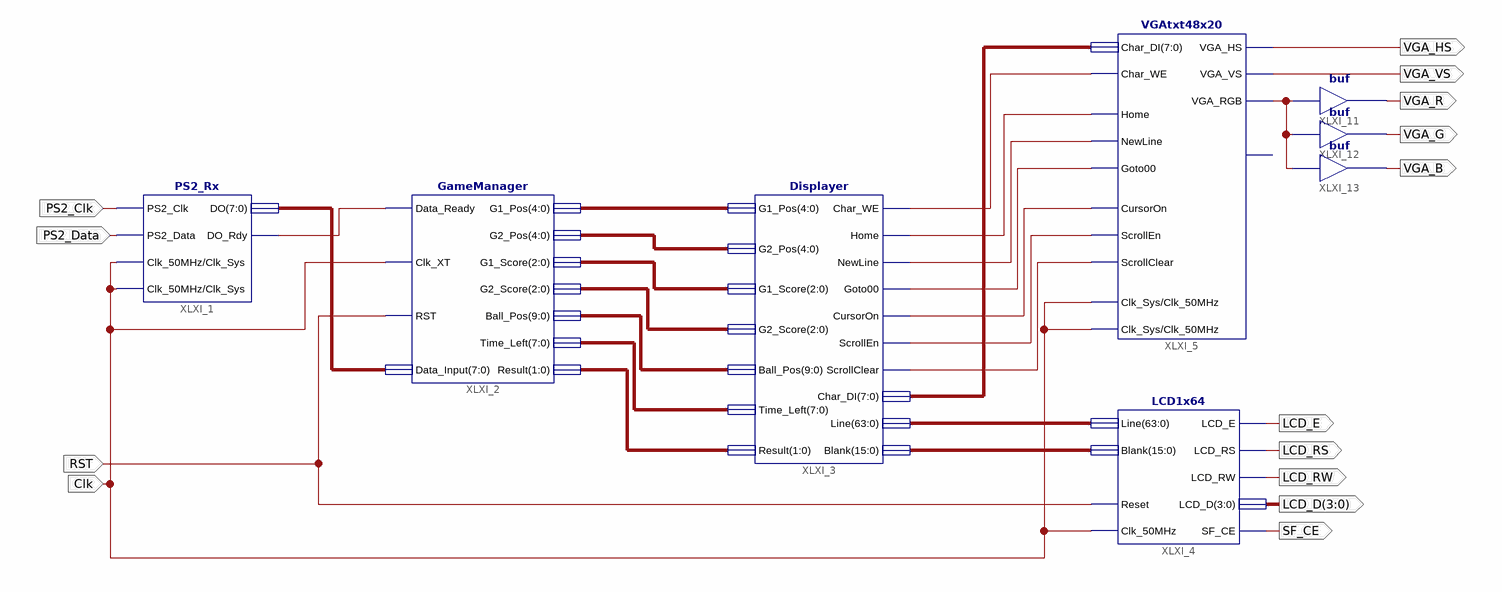
[diagram p0: schematic sheet 1]
// Xilinx ISE schematic Football.sch (spartan3e) as structural Verilog: 8 symbols, 14 ports
module Football (
  input  RST,
  input  Clk,
  input  PS2_Clk,
  input  PS2_Data,
  output VGA_HS,
  output VGA_VS,
  output VGA_R,
  output VGA_G,
  output VGA_B,
  output LCD_E,
  output LCD_RS,
  output LCD_RW,
  output [3:0] LCD_D,
  output SF_CE
);

  wire XLXN_2, XLXN_11, XLXN_12, XLXN_13, XLXN_14, XLXN_15, XLXN_16, XLXN_17, XLXN_54;
  wire [1:0] XLXN_9;
  wire [2:0] XLXN_5, XLXN_6;
  wire [4:0] XLXN_3, XLXN_4;
  wire [7:0] XLXN_1, XLXN_8, XLXN_10;
  wire [9:0] XLXN_7;
  wire [15:0] XLXN_19;
  wire [63:0] XLXN_18;

  PS2_Rx XLXI_1 (.PS2_Clk(PS2_Clk), .PS2_Data(PS2_Data), .Clk_50MHz(Clk), .Clk_Sys(Clk), .DO_Rdy(XLXN_2), .DO(XLXN_1));
  GameManager XLXI_2 (
    .Data_Ready(XLXN_2), .Clk_XT(Clk), .RST(RST), .Data_Input(XLXN_1), .G1_Pos(XLXN_3), .G2_Pos(XLXN_4),
    .G1_Score(XLXN_5), .G2_Score(XLXN_6), .Ball_Pos(XLXN_7), .Time_Left(XLXN_8), .Result(XLXN_9));
  Displayer XLXI_3 (
    .G1_Pos(XLXN_3), .G2_Pos(XLXN_4), .G1_Score(XLXN_5), .G2_Score(XLXN_6), .Ball_Pos(XLXN_7),
    .Time_Left(XLXN_8), .Result(XLXN_9), .Char_WE(XLXN_11), .Home(XLXN_12), .NewLine(XLXN_13),
    .Goto00(XLXN_14), .CursorOn(XLXN_15), .ScrollEn(XLXN_16), .ScrollClear(XLXN_17), .Char_DI(XLXN_10),
    .Line(XLXN_18), .Blank(XLXN_19));
  VGAtxt48x20 XLXI_5 (
    .Char_DI(XLXN_10), .Home(XLXN_12), .NewLine(XLXN_13), .Goto00(XLXN_14), .Clk_Sys(Clk), .Clk_50MHz(Clk),
    .CursorOn(XLXN_15), .ScrollEn(XLXN_16), .ScrollClear(XLXN_17), .VGA_HS(VGA_HS), .VGA_VS(VGA_VS),
    .VGA_RGB(XLXN_54), .Char_WE(XLXN_11));  // open: Busy
  LCD1x64 XLXI_4 (
    .Clk_50MHz(Clk), .Reset(RST), .Line(XLXN_18), .Blank(XLXN_19), .LCD_D(LCD_D), .LCD_E(LCD_E),
    .LCD_RW(LCD_RW), .LCD_RS(LCD_RS), .SF_CE(SF_CE));
  buf XLXI_11 (VGA_R, XLXN_54);
  buf XLXI_12 (VGA_G, XLXN_54);
  buf XLXI_13 (VGA_B, XLXN_54);
endmodule
